# Altium schematic sheet ReferenceVoltageGen.SchDoc
size A
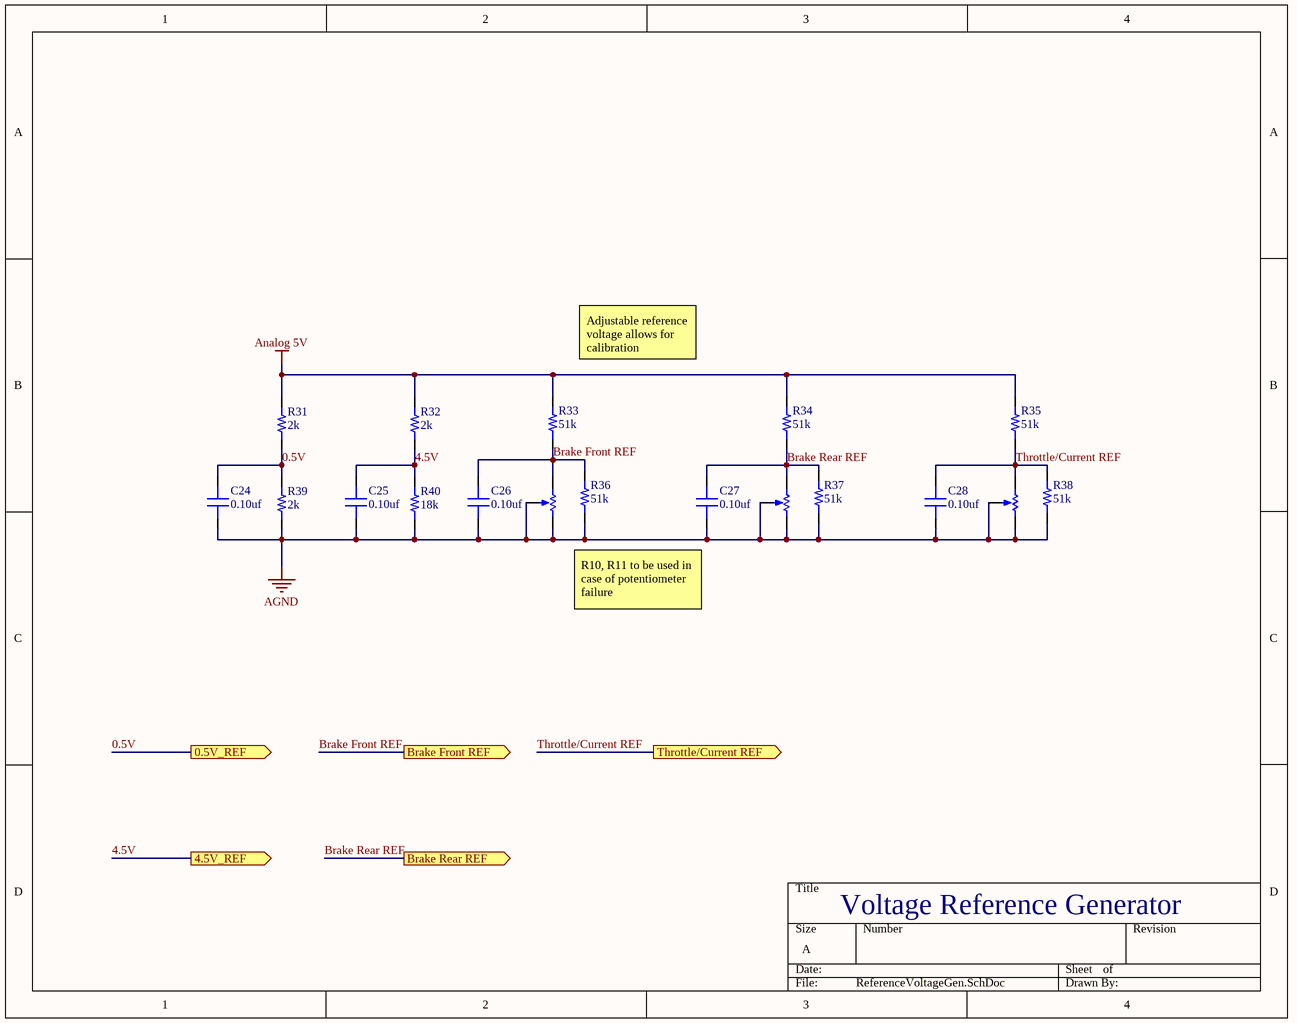
[diagram p0: ReferenceVoltageGen.SchDoc]

## Parts
BRAKE_FRONT_POT1  RV6LAYSA502A  [RV6LAYSA502A]  (value not drawn)
BRAKE_REAR_POT1  RV6LAYSA502A  [RV6LAYSA502A]  (value not drawn)
BRAKE_REAR_POT2  RV6LAYSA502A  [RV6LAYSA502A]  (value not drawn)
C24  value 0.10uf  [CAP 0805/2012]  (hidden comment: Capacitor MLCC 0.10uf 16V CAP 0805/2012)
C25  value 0.10uf  [CAP 0805/2012]  (hidden comment: Capacitor MLCC 0.10uf 16V CAP 0805/2012)
C26  value 0.10uf  [CAP 0805/2012]  (hidden comment: Capacitor MLCC 0.10uf 16V CAP 0805/2012)
C27  value 0.10uf  [CAP 0805/2012]  (hidden comment: Capacitor MLCC 0.10uf 16V CAP 0805/2012)
C28  value 0.10uf  [CAP 0805/2012]  (hidden comment: Capacitor MLCC 0.10uf 16V CAP 0805/2012)
R31  resistance: 2k  [0603]  (hidden comment: resistor)
R32  resistance: 2k  [0603]  (hidden comment: resistor)
R33  resistance: 51k  [0603]  (hidden comment: resistor)
R34  resistance: 51k  [0603]  (hidden comment: resistor)
R35  resistance: 51k  [0603]  (hidden comment: resistor)
R36  resistance: 51k  [0603]  (hidden comment: resistor)
R37  resistance: 51k  [0603]  (hidden comment: resistor)
R38  resistance: 51k  [0603]  (hidden comment: resistor)
R39  resistance: 2k  [0603]  (hidden comment: resistor)
R40  resistance: 18k  [0603]  (hidden comment: resistor)

## Ports
0.5V_REF (out), 4.5V_REF (out), Brake Front REF (out), Brake Rear REF (out), Throttle/Current REF (out)

## Nets
AGND: BRAKE_FRONT_POT1.2(TAP) BRAKE_FRONT_POT1.3(BOT) BRAKE_REAR_POT1.2(TAP) BRAKE_REAR_POT1.3(BOT) BRAKE_REAR_POT2.2(TAP) BRAKE_REAR_POT2.3(BOT) C24.1 C25.1 C26.1 C27.1 C28.1 R36.1 R37.1 R38.1 R39.1 R40.1
Analog 5V: R31.2 R32.2 R33.2 R34.2 R35.2
0.5V: C24.2 R31.1 R39.2 ; port 0.5V_REF
4.5V: C25.2 R32.1 R40.2 ; port 4.5V_REF
Brake Front REF: BRAKE_FRONT_POT1.1(TOP) C26.2 R33.1 R36.2 ; port Brake Front REF
Brake Rear REF: BRAKE_REAR_POT1.1(TOP) C27.2 R34.1 R37.2 ; port Brake Rear REF
Throttle/Current REF: BRAKE_REAR_POT2.1(TOP) C28.2 R35.1 R38.2 ; port Throttle/Current REF

## Notes on the sheet
- Adjustable reference voltage allows for calibration
- R10, R11 to be used in case of potentiometer failure
- Voltage Reference Generator

## Library data of the parts
BRAKE_FRONT_POT1 BRAKE_REAR_POT1 BRAKE_REAR_POT2 = 1: idTable: 1; Name: RV6LAYSA502A_rotary_pot; Value: 100-5M Ohms; Manufacturer_id: 1; Drawer_id: 1; Link: https://www.digikey.com/product-detail/en/precision-electronics-corporation/RV6LAYSA502A/RV6L502C-ND/222820; ComponentLink1Description: Datasheet
C24-C28 = 343: Manufacturer_id: 1; idCapacitor: 343; Name: Cap_0.10uf_16V_CAP 0805/2012; Dielectric: Ceramic; Created_By: Nick Mah; Drawer_id: 1; Voltage_Rating: 16V; Package: CAP 0805/2012; Created_Date: 10/20/2018
R31-R40 = 1: id: 1; name: 0603 Resistor; percent tolerance: 5; package: 0603; quantity: 0